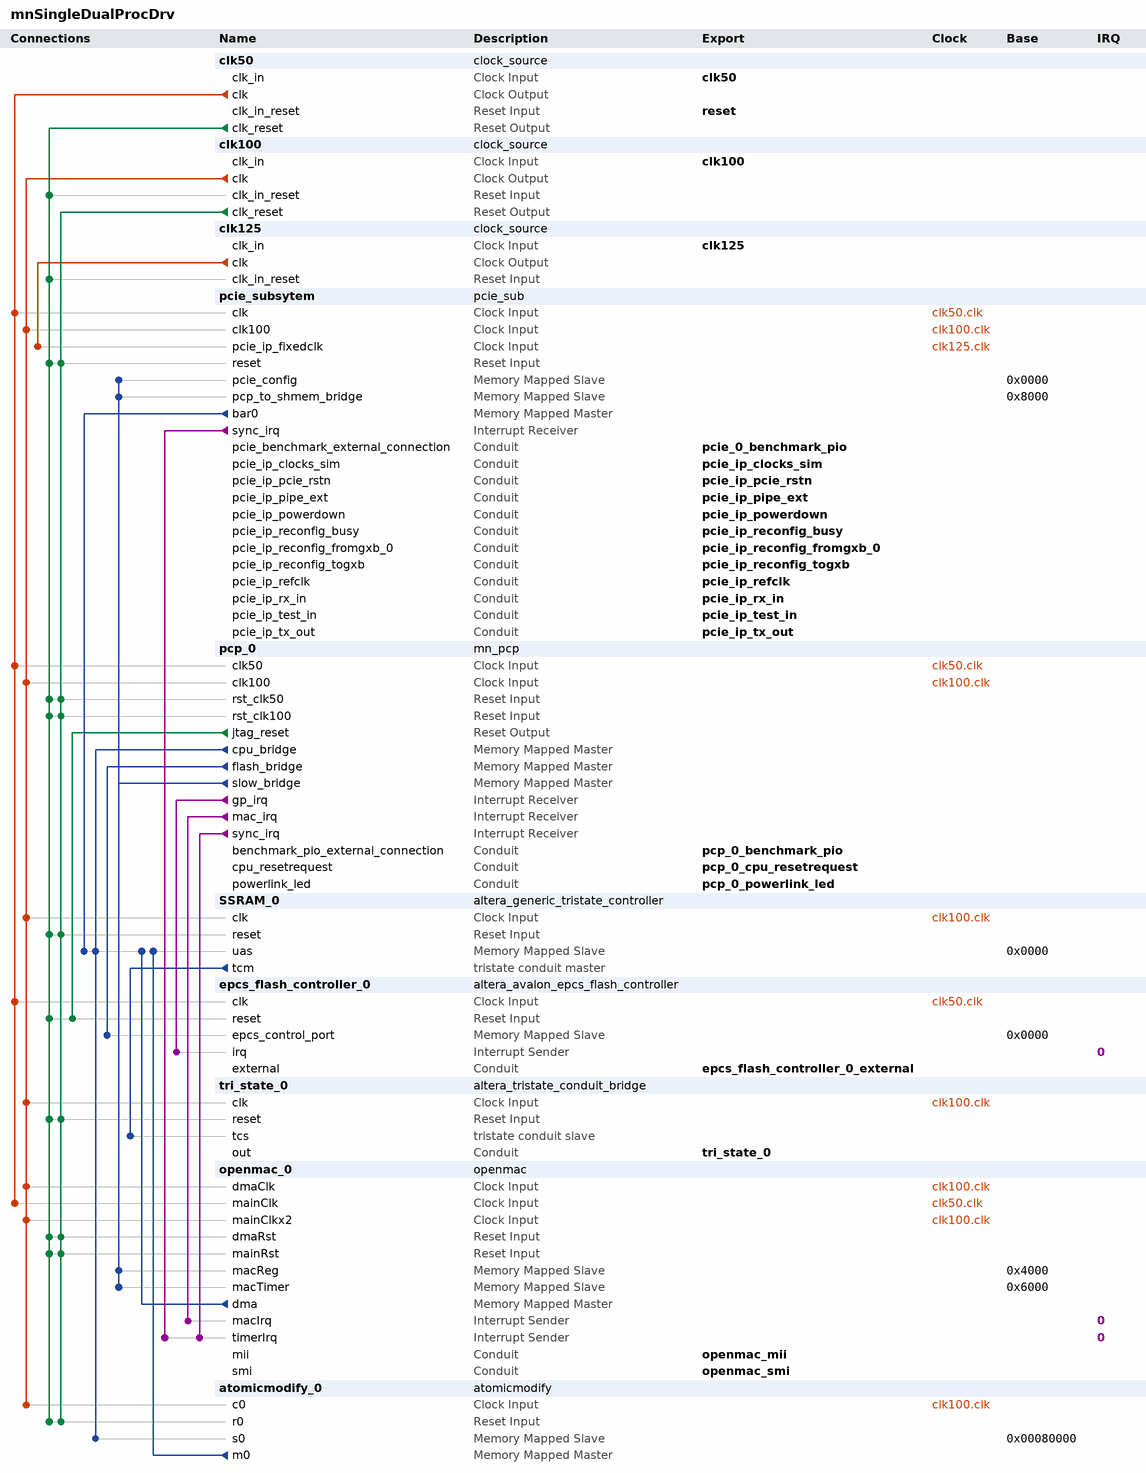
[diagram p0: system contents]
# Platform Designer (Qsys) system mnSingleDualProcDrv, Cyclone IV GX EP4CGX150DF31C7
# Parameters at their usual value, and those the tool derives, are not listed.
package require -exact qsys 13.0
create_system mnSingleDualProcDrv
set_project_property DEVICE_FAMILY {Cyclone IV GX}
set_project_property DEVICE EP4CGX150DF31C7

add_instance clk50 clock_source 13.0
set_instance_parameter_value clk50 clockFrequency 50000000

add_instance clk100 clock_source 13.0
set_instance_parameter_value clk100 clockFrequency 100000000

add_instance clk125 clock_source 13.0
set_instance_parameter_value clk125 clockFrequency 125000000

add_instance pcie_subsytem pcie_sub 1.0
set_instance_parameter_value pcie_subsytem vendor_id 4466
set_instance_parameter_value pcie_subsytem device_id 57345
set_instance_parameter_value pcie_subsytem revision_id 1
set_instance_parameter_value pcie_subsytem class_code 0
set_instance_parameter_value pcie_subsytem subsystem_vendor_id 4466
set_instance_parameter_value pcie_subsytem subsystem_id 4

add_instance pcp_0 mn_pcp 1.0
set_instance_parameter_value pcp_0 cpu0_resetCpuBridge flash_bridge

add_instance SSRAM_0 altera_generic_tristate_controller 13.0
set_instance_parameter_value SSRAM_0 TCM_ADDRESS_W 19
set_instance_parameter_value SSRAM_0 TCM_DATA_W 32
set_instance_parameter_value SSRAM_0 TCM_BYTEENABLE_W 4
set_instance_parameter_value SSRAM_0 TCM_READ_WAIT 0
set_instance_parameter_value SSRAM_0 TCM_WRITE_WAIT 0
set_instance_parameter_value SSRAM_0 TCM_SETUP_WAIT 0
set_instance_parameter_value SSRAM_0 TCM_DATA_HOLD 0
set_instance_parameter_value SSRAM_0 TCM_MAX_PENDING_READ_TRANSACTIONS 5
set_instance_parameter_value SSRAM_0 TCM_TURNAROUND_TIME 2
set_instance_parameter_value SSRAM_0 TCM_TIMING_UNITS 1
set_instance_parameter_value SSRAM_0 TCM_READLATENCY 4
set_instance_parameter_value SSRAM_0 TCM_SYMBOLS_PER_WORD 4
set_instance_parameter_value SSRAM_0 USE_READ 0
set_instance_parameter_value SSRAM_0 USE_BEGINTRANSFER 1
set_instance_parameter_value SSRAM_0 USE_BYTEENABLE 1
set_instance_parameter_value SSRAM_0 USE_OUTPUTENABLE 1
set_instance_parameter_value SSRAM_0 ACTIVE_LOW_READ 0
set_instance_parameter_value SSRAM_0 ACTIVE_LOW_BYTEENABLE 1
set_instance_parameter_value SSRAM_0 ACTIVE_LOW_OUTPUTENABLE 1
set_instance_parameter_value SSRAM_0 ACTIVE_LOW_BEGINTRANSFER 1
set_instance_parameter_value SSRAM_0 CHIPSELECT_THROUGH_READLATENCY 1
set_instance_parameter_value SSRAM_0 MODULE_ASSIGNMENT_KEYS embeddedsw.configuration.hwClassnameDriverSupportList,embeddedsw.CMacro.SRAM_MEMORY_SIZE,embeddedsw.CMacro.SRAM_MEMORY_UNITS,embeddedsw.CMacro.SSRAM_DATA_WIDTH,embeddedsw.CMacro.SSRAM_READ_LATENCY,embeddedsw.memoryInfo.MEM_INIT_DATA_WIDTH,embeddedsw.memoryInfo.HAS_BYTE_LANE,embeddedsw.memoryInfo.GENERATE_DAT_SYM,embeddedsw.memoryInfo.DAT_SYM_INSTALL_DIR
set_instance_parameter_value SSRAM_0 MODULE_ASSIGNMENT_VALUES "altera_avalon_lan91c111\\,altera_avalon_cfi_flash,2,4194304,32,2,32,1,1,SIM_DIR"
set_instance_parameter_value SSRAM_0 INTERFACE_ASSIGNMENT_KEYS embeddedsw.configuration.isMemoryDevice
set_instance_parameter_value SSRAM_0 INTERFACE_ASSIGNMENT_VALUES 1

add_instance epcs_flash_controller_0 altera_avalon_epcs_flash_controller 13.0.1.99.2

add_instance tri_state_0 altera_tristate_conduit_bridge 13.0

add_instance openmac_0 openmac 1.0.2
set_instance_parameter_value openmac_0 gui_phyType 2
set_instance_parameter_value openmac_0 gui_phyCount 1
set_instance_parameter_value openmac_0 gui_extraSmi false
set_instance_parameter_value openmac_0 gui_txBufLoc 2
set_instance_parameter_value openmac_0 gui_txBufSize 16
set_instance_parameter_value openmac_0 gui_txBurstSize 1
set_instance_parameter_value openmac_0 gui_rxBurstSize 8
set_instance_parameter_value openmac_0 gui_tmrCount 1
set_instance_parameter_value openmac_0 gui_actEn false
set_instance_parameter_value openmac_0 gui_sdcEn true

add_instance atomicmodify_0 atomicmodify 1.1.0
set_instance_parameter_value atomicmodify_0 sys_m0Addrw 19

# connections
add_connection clk50.clk epcs_flash_controller_0.clk clock
add_connection clk50.clk openmac_0.mainClk clock
add_connection clk50.clk pcie_subsytem.clk clock
add_connection clk50.clk pcp_0.clk50 clock
add_connection clk100.clk atomicmodify_0.c0 clock
add_connection clk100.clk openmac_0.dmaClk clock
add_connection clk100.clk openmac_0.mainClkx2 clock
add_connection clk100.clk pcie_subsytem.clk100 clock
add_connection clk100.clk pcp_0.clk100 clock
add_connection clk100.clk SSRAM_0.clk clock
add_connection clk100.clk tri_state_0.clk clock
add_connection clk125.clk pcie_subsytem.pcie_ip_fixedclk clock
add_connection clk50.clk_reset atomicmodify_0.r0 reset
add_connection clk50.clk_reset clk100.clk_in_reset reset
add_connection clk50.clk_reset clk125.clk_in_reset reset
add_connection clk50.clk_reset epcs_flash_controller_0.reset reset
add_connection clk50.clk_reset openmac_0.dmaRst reset
add_connection clk50.clk_reset openmac_0.mainRst reset
add_connection clk50.clk_reset pcie_subsytem.reset reset
add_connection clk50.clk_reset pcp_0.rst_clk50 reset
add_connection clk50.clk_reset pcp_0.rst_clk100 reset
add_connection clk50.clk_reset SSRAM_0.reset reset
add_connection clk50.clk_reset tri_state_0.reset reset
add_connection clk100.clk_reset atomicmodify_0.r0 reset
add_connection clk100.clk_reset openmac_0.dmaRst reset
add_connection clk100.clk_reset openmac_0.mainRst reset
add_connection clk100.clk_reset pcie_subsytem.reset reset
add_connection clk100.clk_reset pcp_0.rst_clk50 reset
add_connection clk100.clk_reset pcp_0.rst_clk100 reset
add_connection clk100.clk_reset SSRAM_0.reset reset
add_connection clk100.clk_reset tri_state_0.reset reset
add_connection pcp_0.jtag_reset epcs_flash_controller_0.reset reset
add_connection atomicmodify_0.m0 SSRAM_0.uas avalon
set_connection_parameter_value atomicmodify_0.m0/SSRAM_0.uas baseAddress 0x0000
add_connection openmac_0.dma SSRAM_0.uas avalon
set_connection_parameter_value openmac_0.dma/SSRAM_0.uas baseAddress 0x0000
add_connection pcie_subsytem.bar0 SSRAM_0.uas avalon
set_connection_parameter_value pcie_subsytem.bar0/SSRAM_0.uas baseAddress 0x0000
add_connection pcp_0.cpu_bridge atomicmodify_0.s0 avalon
set_connection_parameter_value pcp_0.cpu_bridge/atomicmodify_0.s0 baseAddress 0x00080000
add_connection pcp_0.cpu_bridge SSRAM_0.uas avalon
set_connection_parameter_value pcp_0.cpu_bridge/SSRAM_0.uas baseAddress 0x0000
add_connection pcp_0.flash_bridge epcs_flash_controller_0.epcs_control_port avalon
set_connection_parameter_value pcp_0.flash_bridge/epcs_flash_controller_0.epcs_control_port baseAddress 0x0000
add_connection pcp_0.slow_bridge openmac_0.macReg avalon
set_connection_parameter_value pcp_0.slow_bridge/openmac_0.macReg baseAddress 0x4000
add_connection pcp_0.slow_bridge openmac_0.macTimer avalon
set_connection_parameter_value pcp_0.slow_bridge/openmac_0.macTimer baseAddress 0x6000
add_connection pcp_0.slow_bridge pcie_subsytem.pcie_config avalon
set_connection_parameter_value pcp_0.slow_bridge/pcie_subsytem.pcie_config baseAddress 0x0000
add_connection pcp_0.slow_bridge pcie_subsytem.pcp_to_shmem_bridge avalon
set_connection_parameter_value pcp_0.slow_bridge/pcie_subsytem.pcp_to_shmem_bridge baseAddress 0x8000
add_connection pcie_subsytem.sync_irq openmac_0.timerIrq interrupt
set_connection_parameter_value pcie_subsytem.sync_irq/openmac_0.timerIrq irqNumber 0
add_connection pcp_0.gp_irq epcs_flash_controller_0.irq interrupt
set_connection_parameter_value pcp_0.gp_irq/epcs_flash_controller_0.irq irqNumber 0
add_connection pcp_0.mac_irq openmac_0.macIrq interrupt
set_connection_parameter_value pcp_0.mac_irq/openmac_0.macIrq irqNumber 0
add_connection pcp_0.sync_irq openmac_0.timerIrq interrupt
set_connection_parameter_value pcp_0.sync_irq/openmac_0.timerIrq irqNumber 0
add_connection SSRAM_0.tcm tri_state_0.tcs tristate_conduit

# exported interfaces
add_interface clk50 clock sink
set_interface_property clk50 EXPORT_OF clk50.clk_in
add_interface reset reset sink
set_interface_property reset EXPORT_OF clk50.clk_in_reset
add_interface clk100 clock sink
set_interface_property clk100 EXPORT_OF clk100.clk_in
add_interface pcie_ip_reconfig_togxb conduit end
set_interface_property pcie_ip_reconfig_togxb EXPORT_OF pcie_subsytem.pcie_ip_reconfig_togxb
add_interface pcie_ip_refclk conduit end
set_interface_property pcie_ip_refclk EXPORT_OF pcie_subsytem.pcie_ip_refclk
add_interface pcie_ip_test_in conduit end
set_interface_property pcie_ip_test_in EXPORT_OF pcie_subsytem.pcie_ip_test_in
add_interface pcie_ip_pcie_rstn conduit end
set_interface_property pcie_ip_pcie_rstn EXPORT_OF pcie_subsytem.pcie_ip_pcie_rstn
add_interface pcie_ip_clocks_sim conduit end
set_interface_property pcie_ip_clocks_sim EXPORT_OF pcie_subsytem.pcie_ip_clocks_sim
add_interface pcie_ip_reconfig_busy conduit end
set_interface_property pcie_ip_reconfig_busy EXPORT_OF pcie_subsytem.pcie_ip_reconfig_busy
add_interface pcie_ip_pipe_ext conduit end
set_interface_property pcie_ip_pipe_ext EXPORT_OF pcie_subsytem.pcie_ip_pipe_ext
add_interface pcie_ip_rx_in conduit end
set_interface_property pcie_ip_rx_in EXPORT_OF pcie_subsytem.pcie_ip_rx_in
add_interface pcie_ip_tx_out conduit end
set_interface_property pcie_ip_tx_out EXPORT_OF pcie_subsytem.pcie_ip_tx_out
add_interface pcie_ip_reconfig_fromgxb_0 conduit end
set_interface_property pcie_ip_reconfig_fromgxb_0 EXPORT_OF pcie_subsytem.pcie_ip_reconfig_fromgxb_0
add_interface tri_state_0 conduit end
set_interface_property tri_state_0 EXPORT_OF tri_state_0.out
add_interface openmac_mii conduit end
set_interface_property openmac_mii EXPORT_OF openmac_0.mii
add_interface openmac_smi conduit end
set_interface_property openmac_smi EXPORT_OF openmac_0.smi
add_interface pcp_0_benchmark_pio conduit end
set_interface_property pcp_0_benchmark_pio EXPORT_OF pcp_0.benchmark_pio_external_connection
add_interface pcp_0_cpu_resetrequest conduit end
set_interface_property pcp_0_cpu_resetrequest EXPORT_OF pcp_0.cpu_resetrequest
add_interface clk125 clock sink
set_interface_property clk125 EXPORT_OF clk125.clk_in
add_interface pcie_ip_powerdown conduit end
set_interface_property pcie_ip_powerdown EXPORT_OF pcie_subsytem.pcie_ip_powerdown
add_interface epcs_flash_controller_0_external conduit end
set_interface_property epcs_flash_controller_0_external EXPORT_OF epcs_flash_controller_0.external
add_interface pcp_0_powerlink_led conduit end
set_interface_property pcp_0_powerlink_led EXPORT_OF pcp_0.powerlink_led
add_interface pcie_0_benchmark_pio conduit end
set_interface_property pcie_0_benchmark_pio EXPORT_OF pcie_subsytem.pcie_benchmark_external_connection

set_interconnect_requirement {$system} qsys_mm.clockCrossingAdapter HANDSHAKE
set_interconnect_requirement {$system} qsys_mm.maxAdditionalLatency 1

save_system mnSingleDualProcDrv.qsys
